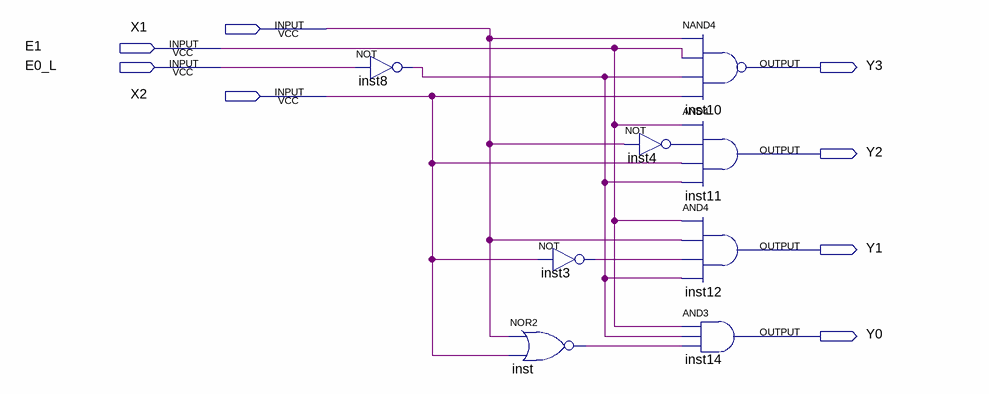
[diagram p0: schematic sheet]
// Quartus schematic Dec2_4.bdf as structural Verilog: 8 symbols, 8 pins
module Dec2_4 (
  input  X1,
  input  E1,
  input  E0_L,
  input  X2,
  output Y3,
  output Y2,
  output Y1,
  output Y0
);

  wire inst3_out, inst4_out, inst8_out, inst_out;

  not inst8 (inst8_out, E0_L);
  nor inst (inst_out, X1, X2);
  not inst3 (inst3_out, X2);
  not inst4 (inst4_out, X1);
  nand inst10 (Y3, X1, E1, inst8_out, X2);
  and inst11 (Y2, E1, inst4_out, X2, inst8_out);
  and inst12 (Y1, E1, X1, inst3_out, inst8_out);
  and inst14 (Y0, E1, inst8_out, inst_out);
endmodule
